# EAGLE design Arduino_shield_w5500 (EAGLE 6.5.0)
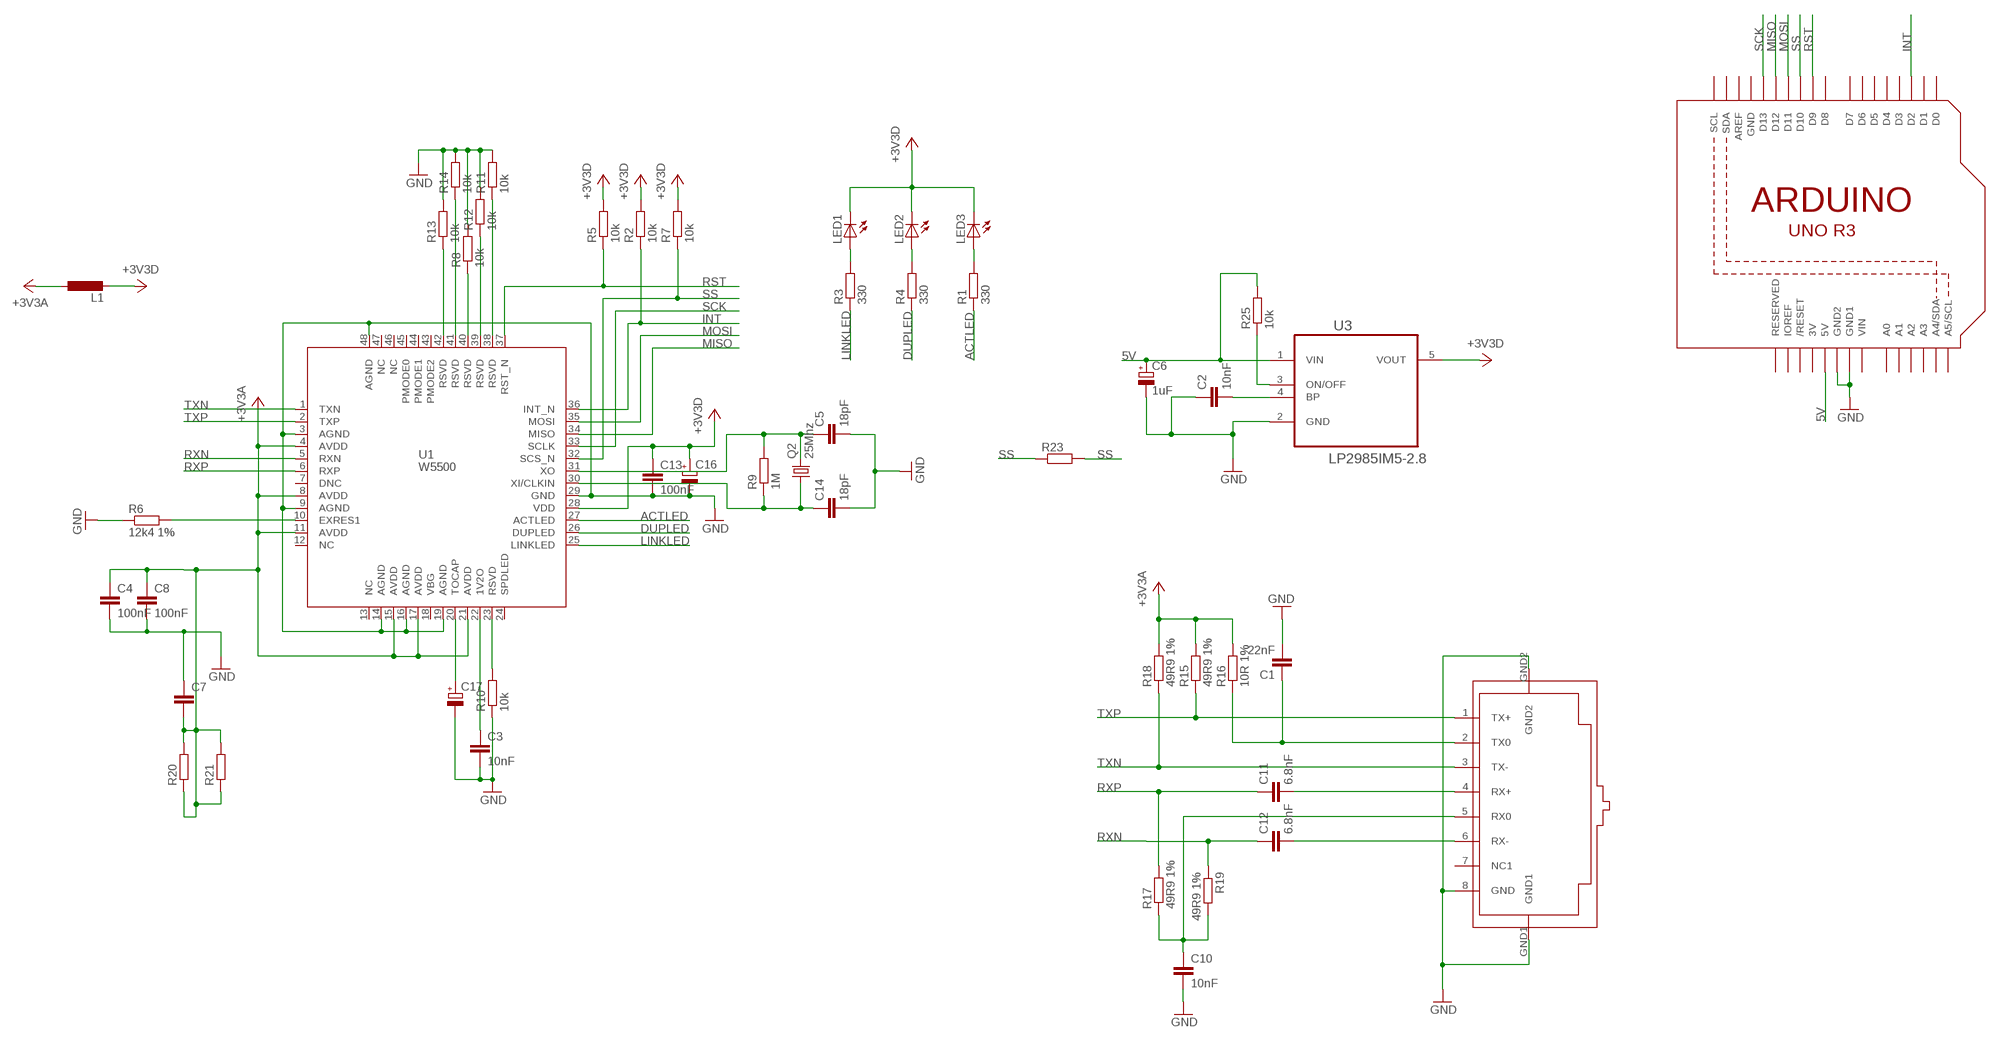
[diagram p0: schematic, sheet 1]

## Parts
C1  22nF  C-EUC1206K  [C1206K]
C2  10nF  C-EUC1206  [C1206]
C3  10nF  C-EUC1206K  [C1206K]
C4  100nF  C-EUC1206K  [C1206K]
C5  18pF  C-EUC1206K  [C1206K]
C6  1uF  CPOL-EU153CLV-0405  [153CLV-0405]
C7  C-EUC1206  [C1206]
C8  100nF  C-EUC1206K  [C1206K]
C10  10nF  C-EUC1206K  [C1206K]
C11  6.8nF  C-EUC1206K  [C1206K]
C12  6.8nF  C-EUC1206K  [C1206K]
C13  100nF  C-EUC1206K  [C1206K]
C14  18pF  C-EUC1206K  [C1206K]
C16  CPOL-EU153CLV-0505  [153CLV-0505]
C17  CPOL-EU153CLV-0405  [153CLV-0405]
L1  L-EUL3225M  [L3225M]
LED1  LED3MM  [LED3MM]
LED2  LED3MM  [LED3MM]
LED3  LED3MM  [LED3MM]
Q2  25Mhz  CRYSTALCTS406  [CTS406]
R1  330  R-EU_R1206W  [R1206W]
R2  10k  R-EU_R1206W  [R1206W]
R3  330  R-EU_R1206W  [R1206W]
R4  330  R-EU_R1206W  [R1206W]
R5  10k  R-EU_R1206W  [R1206W]
R6  12k4 1%  R-EU_R1206W  [R1206W]
R7  10k  R-EU_R1206W  [R1206W]
R8  10k  R-EU_R1206W  [R1206W]
R9  1M  R-EU_R1206W  [R1206W]
R10  10k  R-EU_R1206W  [R1206W]
R11  10k  R-EU_R1206W  [R1206W]
R12  10k  R-EU_R1206W  [R1206W]
R13  10k  R-EU_R1206W  [R1206W]
R14  10k  R-EU_R1206W  [R1206W]
R15  49R9 1%  R-EU_R1206W  [R1206W]
R16  10R 1%  R-EU_R1206W  [R1206W]
R17  49R9 1%  R-EU_R1206W  [R1206W]
R18  49R9 1%  R-EU_R1206W  [R1206W]
R19  49R9 1%  R-EU_R1206W  [R1206W]
R20  R-EU_R1206W  [R1206W]
R21  R-EU_R1206W  [R1206W]
R23  R-EU_R1206W  [R1206W]
R25  10k  R-EU_R1206W  [R1206W]
U1  W5500  [W5500]
U2  ARDUINOR3-DIMENSION  [ARDUINOR3]
U3  LP2985IM5-2.8  [SOT95P284X120-5N]
U$2  RJ45-TRAFO  [RJ45-TRAFO]

## Nets
5V: C6.+ R25.2 U2.5V U3.1(VIN)
+3V3: U3.5(VOUT) ; supply symbol labelled +3V3D
+3V3A: C4.1 C7.2 C8.1 L1.1 R15.2 R16.2 R18.2 R20.1 R20.2 R21.1 R21.2 U1.4(AVDD) U1.8(AVDD) U1.11(AVDD) U1.15(AVDD) U1.17(AVDD) U1.21(AVDD)
+3V3D: C13.1 C16.+ L1.2 LED1.K(C) LED2.K(C) LED3.K(C) R2.2 R5.2 R7.2 U1.28(VDD)
ACTLED: R1.1 U1.27(ACTLED)
DUPLED: R4.1 U1.26(DUPLED)
GND: C1.2 C2.1 C3.2 C4.2 C5.2 C6.- C8.2 C10.2 C13.2 C14.2 C16.- C17.- R6.1 R8.2 R10.1 R11.2 R12.2 R13.2 R14.2 U1.3(AGND) U1.9(AGND) U1.14(AGND) U1.16(AGND) U1.19(AGND) U1.29(GND) U1.48(AGND) U2.GND1 U2.GND2 U3.2(GND) U$2.8(GND) U$2.GND1 U$2.GND2
INT: R2.1 U1.36(INT_N) U2.D2
LINKLED: R3.1 U1.25(LINKLED)
MISO: U1.34(MISO) U2.D12
MOSI: U1.35(MOSI) U2.D11
N$1: R13.1 U1.42(RSVD)
N$2: LED1.A R3.2
N$3: R14.1 U1.41(RSVD)
N$4: R8.1 U1.40(RSVD)
N$5: R12.1 U1.39(RSVD)
N$6: R11.1 U1.38(RSVD)
N$7: R10.2 U1.23(RSVD)
N$8: C3.1 U1.22(1V2O)
N$9: LED2.A R4.2
N$10: C5.1 Q2.3 R9.2 U1.31(XO)
N$11: C14.1 Q2.1 R9.1 U1.30(XI/CLKIN)
N$12: R6.2 U1.10(EXRES1)
N$13: LED3.A R1.2
N$14: C11.2 U$2.4(RX+)
N$16: C1.1 R16.1 U$2.2(TX0)
N$19: C17.+ U1.20(TOCAP)
N$20: C10.1 R17.1 R19.2 U$2.5(RX0)
N$21: C12.2 U$2.6(RX-)
N$22: C2.2 U3.4(BP)
N$24: R25.1 U3.3(ON/OFF)
RST: R5.1 U1.37(RST_N) U2.D9
RXN: C12.1 R19.1 U1.5(RXN)
RXP: C11.1 R17.2 U1.6(RXP)
SCK: U1.33(SCLK) U2.D13
SS: R7.1 R23.1 R23.2 U1.32(SCS_N) U2.D10
TXN: R18.1 U1.1(TXN) U$2.3(TX-)
TXP: R15.1 U1.2(TXP) U$2.1(TX+)
Unconnected: C7.1 U1.7(DNC) U1.12(NC) U1.13(NC) U1.18(VBG) U1.24(SPDLED) U1.43(PMODE2) U1.44(PMODE1) U1.45(PMODE0) U1.46(NC) U1.47(NC) U2.A0 U2.A1 U2.A2 U2.A3 U2.A4(A4/SDA) U2.A5(A5/SCL) U2.AREF U2.D0 U2.D1 U2.D3 U2.D4 U2.D5 U2.D6 U2.D7 U2.D8 U2.IOREF U2.RESERVED U2.RESET(/RESET) U2.SCL U2.SDA U$2.7(NC1)

## Power pins joined to a net without a drawn wire
3V: U2.3V
GND: U2.GND
VIN: U2.VIN

## Library data of the parts
C1-C5 C7 C8 C10-C14 = rcl:C-EU: CAPACITOR, European symbol
C6 C16 C17 = rcl:CPOL-EU: POLARIZED CAPACITOR, European symbol
L1 = rcl:L-EU: INDUCTOR, European symbol
LED1-LED3 = led:LED: LED OSRAM: - CHIPLED LG R971, LG N971, LY N971, LG Q971, LY Q971, LO R971, LY R971 LH N974, LH R974 LS Q976, LO Q976, LY Q976 LO Q996 - Hyper CHIPLED LW Q18S LB Q993, LB Q99A, LB R99A - SideLED LS A670, LO A670, LY A670, LG A670, LP A670 LB A673, LV A673, LT A673, LW A673 LH A674 LY A675 LS A676, LA A676, LO A676, LY A676, LW A676 LS A679, LY A679, LG A679 - Hyper Micro SIDELED® LS Y876, LA Y876, LO Y876, LY Y876 LT Y87S - SmartLED LW L88C, LW L88S LB L89C, LB L89S, LG L890 LS L89K, LO L89K, LY L89K LS L896, LA L896, LO L896, LY L896 - TOPLED LS T670, LO T670, LY T670, LG T670, LP T670 LSG T670, LSP T670, LSY T670, LOP T670, LYG T670 LG T671, LOG T671, LSG T671 LB T673, LV T673, LT T673, LW T673 LH T674 LS T676, LA T676, LO T676, LY T676, LB T676, LH T676, LSB T676, LW T676 LB T67C, LV T67C, LT T67C, LS T67K, LO T67K, LY T67K, LW E67C LS E67B, LA E67B, LO E67B, LY E67B, LB E67C, LV E67C, LT E67C LW T67C LS T679, LY T679, LG T679 LS T770, LO T770, LY T770, LG T770, LP T770 LB T773, LV T773, LT T773, LW T773 LH T774 LS E675, LA E675, LY E675, LS T675 LS T776, LA T776, LO T776, LY T776, LB T776 LHGB T686 LT T68C, LB T68C - Hyper Mini TOPLED® LB M676 - Mini TOPLED Santana® LG M470 LS M47K, LO M47K, LY M47K Source: http://www.osram.convergy.de LUXEON: - LUMILED® LXK2-PW12-R00, LXK2-PW12-S00, LXK2-PW14-U00, LXK2-PW14-V00 LXK2-PM12-R00, LXK2-PM12-S00, LXK2-PM14-U00 LXK2-PE12-Q00, LXK2-PE12-R00, LXK2-PE12-S00, LXK2-PE14-T00, LXK2-PE14-U00 LXK2-PB12-K00, LXK2-PB12-L00, LXK2-PB12-M00, LXK2-PB14-N00, LXK2-PB14-P00, LXK2-PB14-Q00 LXK2-PR12-L00, LXK2-PR12-M00, LXK2-PR14-Q00, LXK2-PR14-R00 LXK2-PD12-Q00, LXK2-PD12-R00, LXK2-PD12-S00 LXK2-PH12-R00, LXK2-PH12-S00 LXK2-PL12-P00, LXK2-PL12-Q00, LXK2-PL12-R00 Source: www.luxeon.com KINGBRIGHT: KA-3528ASYC Source: www.kingbright.com
Q2 = crystal:CRYSTAL: CRYSTAL; OC_FARNELL: unknown; OC_NEWARK: unknown
R1-R21 R23 R25 = rcl:R-EU_: RESISTOR, European symbol
U1 = W5500:W5500
U2 = adafruit:ARDUINOR3: This is a new object for the new Arduino R3 - with extra pins that you may want to use (such as IOref, and duplicated A4/A5
U3 = Ava:LP2985IM5-2.8: Low-Dropout Regulator; MPN: LP2985IM5-2.8; OC_FARNELL: 1685560; OC_NEWARK: 41K6947; PACKAGE: SOT23-5; SUPPLIER: National Semiconductor
U$2 = con-amphenol-rj45-ld:RJ45-TRAFO: RJ45 socket with integrated magnetics Naming: Amphenol LMJ1598824110DT39 TME RJ45-TRAFO Author: Petr Kalandra <mailto:kalandrap@gmail.com> Datasheet: http://zefiryn.tme.pl/dok/zlacza/rjtrafo.pdf

## Board
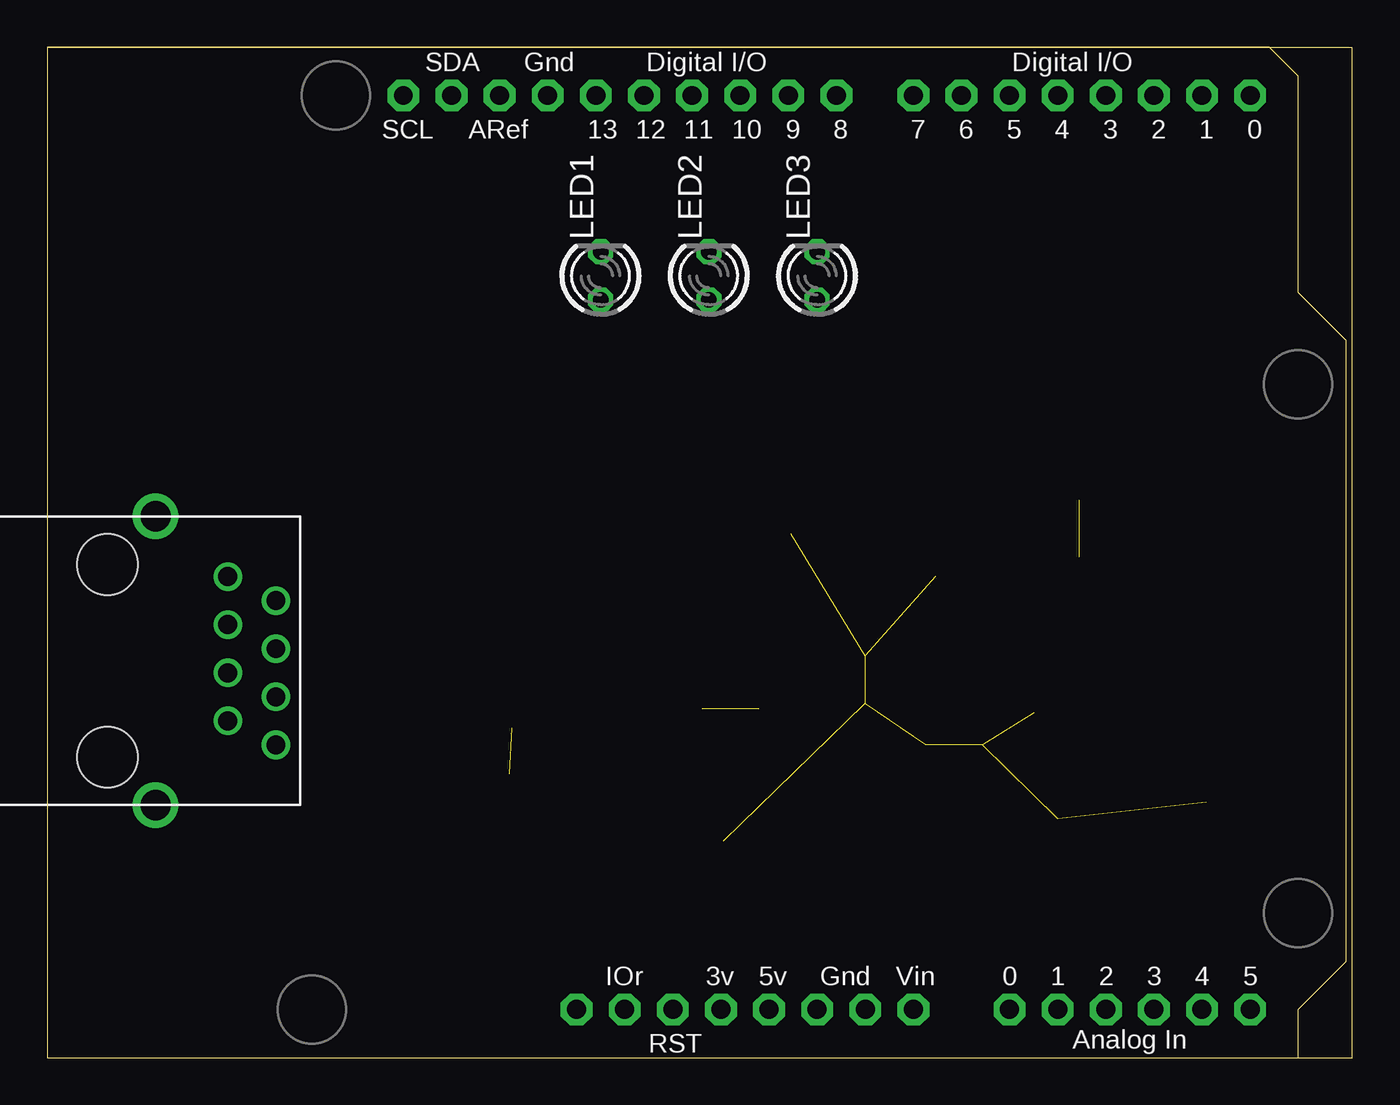
[diagram p1: board, top side]
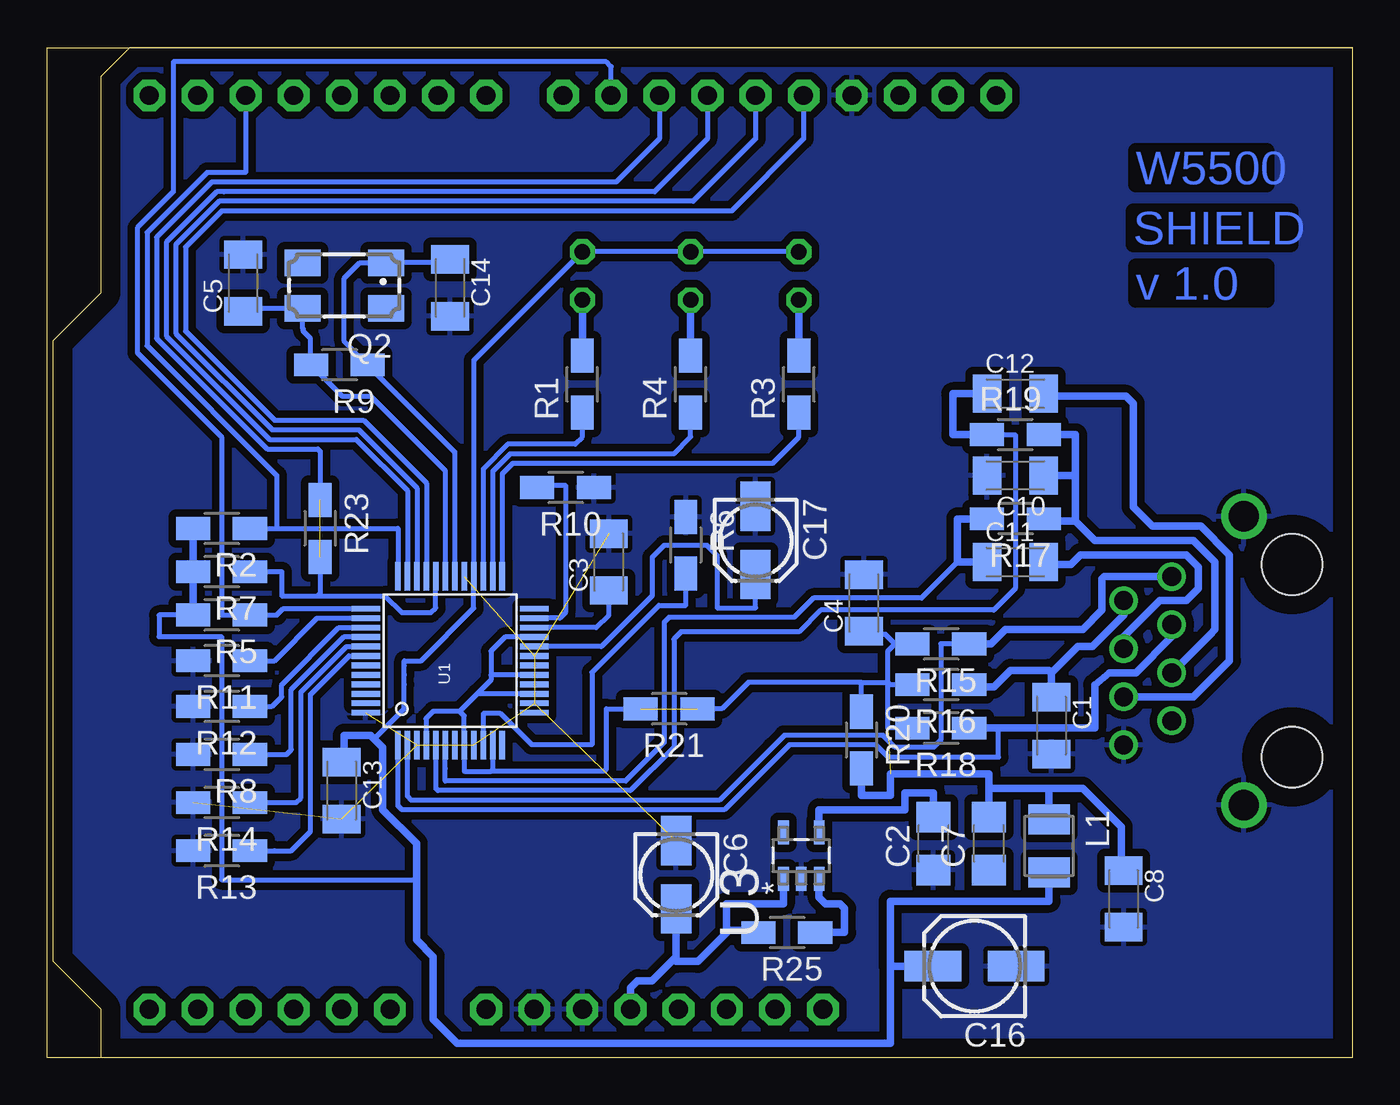
[diagram p2: board, bottom side, seen from below]

Size 68.89 x 53.34 mm. Coordinates in mm from the lower left corner, seen from the top.
Outline: 0,0 68.89,0 68.89,53.33 0,53.33
Copper layers (1*16): Top 0.035mm / dielectric 1.5mm / Bottom 0.035mm
Design rules "default *": minimum track width 10mil, minimum drill 24mil, track to track 8mil, track to pad 8mil, pad to pad 8mil, via to via 8mil, smd to smd 8mil, copper to edge 40mil, drill to drill 8mil, minimum pad ring 10mil, minimum via ring 8mil, stop-mask expansion 4mil, vias tented up to drill 0mil, thermal gap 10mil

### Footprints (pad centres in the part's own frame; a part is rotated, then mirrored left to right if it is on the bottom)
C1206K = smd 1.5 x 2: 1 -1.5,0; 2 1.5,0
C1206 = smd 1.6 x 1.8: 1 -1.4,0; 2 1.4,0
153CLV-0405 = smd 2.6 x 1.6: + 1.8,0; - -1.8,0
153CLV-0505 = smd 3 x 1.6: + 2.2,0; - -2.2,0
L3225M = smd 1.6 x 2.2: 1 -1.4,0; 2 1.4,0
LED3MM = drill 0.813 octagon: A -1.27,0; K 1.27,0
CTS406 = smd 1.9 x 1.4: 1 -2.2,-1.2; 2 2.2,-1.2; 3 2.2,1.2; 4 -2.2,1.2
R1206W = smd 1.8 x 1.2: 1 -1.499,0; 2 1.499,0
W5500 = smd 1.5 x 0.3: 1 -4.45,2.75; 2 -4.45,2.25; 3 -4.45,1.75; 4 -4.45,1.25; 5 -4.45,0.75; 6 -4.45,0.25; 7 -4.45,-0.25; 8 -4.45,-0.75; 9 -4.45,-1.25; 10 -4.45,-1.75; 11 -4.45,-2.25; 12 -4.45,-2.75; 25 4.45,-2.75; 26 4.45,-2.25; 27 4.45,-1.75; 28 4.45,-1.25; 29 4.45,-0.75; 30 4.45,-0.25; 31 4.45,0.25; 32 4.45,0.75; 33 4.45,1.25; 34 4.45,1.75; 35 4.45,2.25; 36 4.45,2.75 | smd 0.3 x 1.5: 13 -2.75,-4.45; 14 -2.25,-4.45; 15 -1.75,-4.45; 16 -1.25,-4.45; 17 -0.75,-4.45; 18 -0.25,-4.45; 19 0.25,-4.45; 20 0.75,-4.45; 21 1.25,-4.45; 22 1.75,-4.45; 23 2.25,-4.45; 24 2.75,-4.45; 37 2.75,4.45; 38 2.25,4.45; 39 1.75,4.45; 40 1.25,4.45; 41 0.75,4.45; 42 0.25,4.45; 43 -0.25,4.45; 44 -0.75,4.45; 45 -1.25,4.45; 46 -1.75,4.45; 47 -2.25,4.45; 48 -2.75,4.45
ARDUINOR3 = drill 1 pad 1.676 octagon: 3V 35.56,2.54; 5V 38.1,2.54; A0 50.8,2.54; A1 53.34,2.54; A2 55.88,2.54; A3 58.42,2.54; A4 60.96,2.54; A5 63.5,2.54; AREF 23.876,50.8; D0 63.5,50.8; D1 60.96,50.8; D2 58.42,50.8; D3 55.88,50.8; D4 53.34,50.8; D5 50.8,50.8; D6 48.26,50.8; D7 45.72,50.8; D8 41.656,50.8; D9 39.116,50.8; D10 36.576,50.8; D11 34.036,50.8; D12 31.496,50.8; D13 28.956,50.8; GND 26.416,50.8; GND1 43.18,2.54; GND2 40.64,2.54; IOREF 30.48,2.54; RESERVED 27.94,2.54; RESET 33.02,2.54; SCL 18.796,50.8; SDA 21.336,50.8; VIN 45.72,2.54
SOT95P284X120-5N = smd 1.27 x 0.559: 1 -1.219,0.94; 2 -1.219,0; 3 -1.219,-0.94; 4 1.219,-0.94; 5 1.219,0.94
RJ45-TRAFO = drill 1: 1 -4.445,6.35; 2 -3.175,8.89; 3 -1.905,6.35; 4 -0.635,8.89; 5 0.635,6.35; 6 1.905,8.89; 7 3.175,6.35; 8 4.445,8.89 | drill 1.6: GND1 -7.62,2.54; GND2 7.62,2.54 | hole 3.2: -5.08,0; 5.08,0

### Placement (x,y rotation side)
C1  15.88,17.53 270 bottom
C2  22.1,11.3 90 bottom
C3  39.24,26.16 90 bottom
C4  25.78,24 90 bottom
C5  58.55,40.89 90 bottom
C6  35.69,9.65 270 bottom
C7  19.18,11.3 90 bottom
C8  12.07,8.38 270 bottom
C10  17.78,30.73 180 bottom
C11  17.78,26.16 0 bottom
C12  17.78,35.05 0 bottom
C13  53.34,14.1 270 bottom
C14  47.62,40.64 270 bottom
C16  19.94,4.83 180 bottom
C17  31.5,27.3 270 bottom
L1  16,11.18 270 bottom
LED1  29.21,41.28 90 top
LED2  34.92,41.28 90 top
LED3  40.64,41.28 90 top
Q2  53.21,40.77 180 bottom
R1  40.64,35.56 90 bottom
R2  59.69,27.94 180 bottom
R3  29.21,35.56 90 bottom
R4  34.92,35.56 90 bottom
R5  59.69,23.37 180 bottom
R6  35.18,27.05 270 bottom
R7  59.69,25.65 180 bottom
R8  59.69,16 180 bottom
R9  53.47,36.58 180 bottom
R10  41.53,30.1 180 bottom
R11  59.69,20.95 180 bottom
R12  59.69,18.54 180 bottom
R13  59.69,10.92 180 bottom
R14  59.69,13.46 180 bottom
R15  21.72,21.84 180 bottom
R16  21.72,19.69 180 bottom
R17  17.78,28.45 180 bottom
R18  21.72,17.4 180 bottom
R19  17.78,32.89 0 bottom
R20  25.91,16.76 270 bottom
R21  36.07,18.41 180 bottom
R23  54.48,27.94 270 bottom
R25  29.85,6.6 180 bottom
U1  47.62,20.95 90 bottom
U2  0,0 0 top
U3  29.08,10.67 90 bottom
U$2  3.17,20.95 270 top

### Tracks (layer width: path | path; a pad name or v marks a point on that pad's centre or on a via)
5V
  Bottom 0.406: R25.2 31.47,6.73 32.89,6.73 | 32.89,6.73 34.54,5.08 35.69,5.08 35.69,5.33 | 35.69,5.33 C6.+ | U2.5V 38.1,3.68 37.72,4.06 36.96,4.06 35.69,5.33 | U3.1 30.02,8.13 30.1,8.13 33.02,8.13 33.02,6.73 32.89,6.73
+3V3A  (2 unrouted)
  Bottom 0.254: 45.47,15.11 39.5,15.11 39.37,15.24 39.37,18.41 R21.2 | U1.11 45.38,15.2 45.47,15.11 | 45.47,15.11 46.86,15.11 46.88,15.12 U1.8 46.88,18.05 47.12,18.29 | 47.12,18.29 48.51,18.29 48.89,17.91 48.89,16.52 U1.4 | U1.15 46.2,19.2 | 46.2,19.2 47.12,18.29 | U1.21 44.72,22.2 45.47,21.46 45.47,20.19 | 45.47,20.19 45.47,19.94 46.2,19.2 | U1.17 45.47,20.19 | R15.2 24.13,21.84 | 24.13,21.84 24.64,22.35 25.63,22.35 C4.1 | R18.2 24.51,17.4 24.51,19.81 | 24.51,19.81 24.51,21.46 24.13,21.84 | R16.2 24.38,19.69 24.51,19.81 | 25.91,19.81 24.51,19.81 | R20.1 25.91,19.81 | 25.91,19.81 31.88,19.81 33.27,18.41 R21.1
  Bottom 0.406: C8.1 12.19,9.88 12.19,12.19 14.22,14.22 16.13,14.22 | 16.13,14.22 19.18,14.22 | 19.18,14.22 C7.2 | L1.1 16,14.1 16.13,14.22 | 19.18,14.22 19.18,14.99 24.38,14.99 24.38,13.84 25.91,13.84 R20.2
+3V3D
  Bottom 0.254: LED1.K LED2.K LED3.K 46.38,36.81 U1.28 | 53.32,15.62 C13.1 | 51.62,16.83 50.04,18.41 50.04,19.69 | 50.04,19.69 50.04,20.19 | 50.04,20.19 50.04,20.7 | 50.04,20.7 50.04,20.95 49.15,20.95 46.38,23.73 U1.28 | 46.35,25.38 U1.28 | 50.04,20.7 | 50.05,20.2 50.04,20.19 | 50.06,19.7 50.04,19.69 | R5.2 62.99,23.37 62.99,22.23 59.69,22.23 59.69,9.4 49.4,9.4
  Bottom 0.406: R2.2 R7.2 R5.2 | 15.88,9.4 L1.2 16,8.25 24.38,8.25 24.38,4.83 | C16.+ 24.38,4.83 | 24.38,4.83 24.38,0.76 32.13,0.76 47.12,0.76 47.24,0.76 48.51,2.03 48.51,5.33 49.4,6.22 49.4,9.4 49.4,11.3 51.18,13.08 51.18,15.11 51.18,16.38 51.62,16.83 51.82,17.02 53.21,17.02 53.21,15.72 C13.1 53.32,15.62
ACTLED
  Bottom 0.254: U1.27 45.88,31.09 44.58,32.38 41.02,32.38 40.64,32.77 R1.1
DUPLED
  Bottom 0.254: U1.26 45.38,30.95 44.45,31.88 35.81,31.88 34.92,32.77 R4.1
FEFEFG
  pour Bottom (isolate 0.406): 0,0 66.04,0 66.04,2.54 68.58,5.08 68.58,38.1 66.04,40.64 66.04,52.07 64.77,53.34 0,53.34
GND  (10 unrouted)
  pour Bottom (isolate 0.406): 0,0 66.04,0 66.04,2.54 68.58,5.08 68.58,37.47 68.58,38.1 66.04,40.64 66.04,51.44 66.04,52.07 64.77,53.34 0,53.34
INT
  Bottom 0.254: R2.1 56.77,27.94 | 56.77,27.94 50.38,27.94 U1.36 | U2.D2 58.42,46.74 60.45,46.74 63.63,43.56 63.63,37.59 56.77,30.73 56.77,27.94
LINKLED
  Bottom 0.254: U1.25 44.88,30.82 44.32,31.37 30.61,31.37 29.21,32.77 R3.1
MISO
  Bottom 0.254: U2.D12 31.5,48.51 34.8,45.21 59.82,45.21 62.1,42.93 62.1,38.23 57.02,33.15 52.45,33.15 49.38,30.07 U1.34
MOSI
  Bottom 0.254: U2.D11 34.04,48.51 36.83,45.72 59.56,45.72 59.94,45.72 62.61,43.05 62.61,38.1 57.15,32.64 52.58,32.64 49.88,29.94 U1.35
N$1
  Bottom 0.254: R13.1 58.06,10.8 57.94,10.92 56.9,10.92 56.01,10.92 54.99,11.94 54.99,19.18 52.96,21.21 U1.42
N$2
  Bottom 0.406: R3.2 LED1.A
N$3
  Bottom 0.254: R14.1 55.75,13.46 55.5,13.72 55.5,19.3 53.1,21.7 U1.41
N$4
  Bottom 0.254: R8.1 56.26,16 56.01,16.26 56.01,19.43 53.21,22.23 52.09,22.23 U1.40
N$5
  Bottom 0.254: R12.1 57.02,18.54 56.52,19.05 56.52,19.69 53.49,22.7 U1.39
N$6
  Bottom 0.254: R11.1 57.94,20.7 57.68,20.95 56.9,20.95 54.65,23.2 U1.38
N$7
  Bottom 0.254: R10.2 42.9,30.23 41.53,30.23 41.53,23.49 41.82,23.2 U1.23
N$8
  Bottom 0.254: U1.22 39.91,22.7 39.24,23.37 C3.1
N$9
  Bottom 0.406: R4.2 LED2.A
N$10
  Bottom 0.254: U1.31 47.88,30.98 51.82,34.92 53.31,34.92 R9.2 54.99,36.6 54.99,37.97 55.37,38.35 55.37,38.48 55.41,38.52 Q2.3 58.12,39.57 C5.1
N$11
  Bottom 0.254: U1.30 47.38,31.98 R9.1 53.21,37.82 53.21,41.15 52.39,41.97 Q2.1 48.31,41.97 C14.1
N$12
  Bottom 0.254: 45.85,16.53 U1.10 45.88,18.16 44.96,18.16 43.31,16.51 40.13,16.51 40.13,20.34 36.6,23.88 35.18,23.88 R6.2
N$13
  Bottom 0.406: R1.2 LED3.A
N$14
  Bottom 0.406: U$2.4 12.07,22.23 11.43,22.86 11.3,22.99 10.16,24.13 8.76,24.13 8.13,24.77 8.13,25.91 8.76,26.54 14.35,26.54 14.48,26.42 14.86,26.04 16.15,26.04 C11.2
N$16
  Bottom 0.406: 20.09,19.56 R16.1 20.09,19.56 | U$2.2 12.07,23.37 13.72,21.72 14.48,21.72 15.88,20.32 | 15.88,20.32 C1.1 | 20.09,19.56 18.92,19.56 18.03,20.45 16,20.45 15.88,20.32
N$19
  Bottom 0.254: U1.20 39.64,21.7 36.96,24.38 36.96,26.42 36.32,27.05 34.06,27.05 33.53,26.52 33.53,23.75 31.5,23.75 C17.+
N$20
  Bottom 0.406: U$2.5 7.49,22.35 7.24,22.61 7.24,26.16 8.38,27.3 13.59,27.3 14.61,28.32 | 14.61,28.32 16.15,28.32 R17.1 | R19.2 14.61,32.89 14.61,30.73 | 14.61,30.73 14.61,28.32 | C10.1 14.61,30.73
N$21
  Bottom 0.406: U$2.6 9.53,19.05 8.38,19.05 6.48,20.95 6.48,26.54 8,28.07 10.54,28.07 11.56,29.08 11.56,34.54 11.94,34.92 16.15,34.92 C12.2
N$22
  Bottom 0.406: U3.4 28.14,13.08 28.07,13.08 23.62,13.08 23.62,13.97 22.1,13.97 C2.2
N$24
  Bottom 0.406: R25.1 26.8,6.6 26.8,7.87 27.05,8.13 27.81,8.13 28.14,8.46 U3.3
RST
  Bottom 0.254: U2.D9 39.12,52.32 39.37,52.58 62.23,52.58 62.23,45.72 64.14,43.81 64.14,37.21 59.69,32.77 59.69,23.37 R5.1 56.77,23.37 56.43,23.7 U1.37
RXN
  Bottom 0.254: R19.1 17.78,32.89 17.78,24.77 18.92,23.62 28.07,23.62 29.21,22.48 34.67,22.48 34.8,22.48 35.43,22.48 35.81,22.1 35.81,16.38 38.1,14.1 48.26,14.1 48.38,14.21 U1.5
  Bottom 0.406: R19.1 21.08,32.89 21.08,35.05 C12.1
RXP
  Bottom 0.254: 20.83,26.16 22.73,24.26 25.65,24.26 27.05,24.26 28.45,24.26 29.46,23.24 36.07,23.24 36.32,22.99 36.32,16.64 38.35,14.61 47.88,14.61 47.88,15.24 U1.6
  Bottom 0.406: R17.2 20.83,28.45 20.83,26.16 C11.1
SCK
  Bottom 0.254: U2.D13 28.96,48.51 32.77,44.7 59.69,44.7 61.59,42.8 61.59,38.35 56.9,33.66 52.2,33.66 48.88,30.33 U1.33 48.89,25.4 48.89,25.91 48.89,25.27
SS  (1 unrouted)
  Bottom 0.254: U1.32 48.39,25.39 48.39,23.75 48.64,23.49 50.16,23.49 51.05,24.38 54.61,24.38 | U2.D10 36.58,48.51 38.86,46.23 60.2,46.23 63.12,43.31 63.12,37.97 57.28,32.13 54.61,32.13 54.48,32 54.48,30.61 R23.1 | R7.1 56.9,25.65 56.52,25.65 56.52,24.38 54.61,24.38 | R23.2 54.48,24.51 54.61,24.38
TXN
  Bottom 0.254: U1.1 50.38,13.29 50.16,13.08 33.15,13.08 29.72,16.51 25.15,16.51 24.51,15.88 18.67,15.88 18.67,17.4
  Bottom 0.406: U$2.3 9.53,22.23 11.43,20.32 12.83,20.32 13.59,19.69 13.59,17.4 18.67,17.4 R18.1
TXP
  Bottom 0.254: R15.1 21.72,21.84 21.72,16.76 22.1,16.38 24.13,16.38 24.77,17.02 29.97,17.02 30.61,16.38 33.4,13.59 49.66,13.59 49.88,13.81 U1.2
  Bottom 0.406: U$2.1 13.08,25.4 13.21,25.27 13.21,23.62 14.22,22.61 18.31,22.61 19.07,21.84 R15.1

### Text on the board
Bottom: W5500 | SHIELD | v 1.0